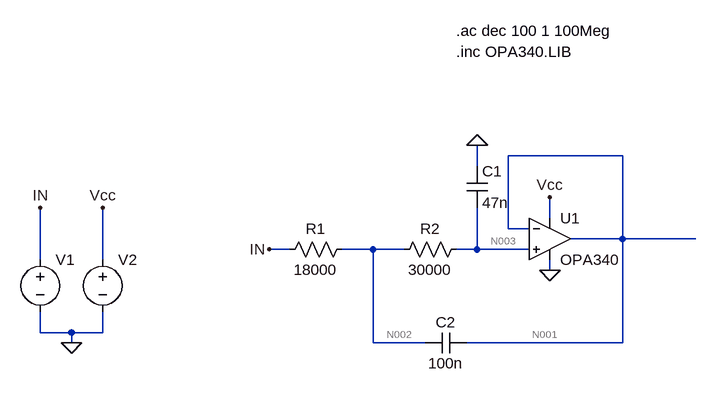
[diagram p0: schematic Sallen-Key-Filter.asc]
Sallen-Key-Filter.asc, the LTspice schematic file:
Version 4
SHEET 1 880 680
WIRE 448 112 272 112
WIRE 224 128 224 96
WIRE 336 208 336 176
WIRE 272 224 272 112
WIRE 304 224 272 224
WIRE 448 240 448 112
WIRE 448 240 368 240
WIRE 560 240 448 240
WIRE -64 256 -96 256
WIRE 64 256 16 256
WIRE 112 256 64 256
WIRE 224 256 224 192
WIRE 224 256 192 256
WIRE 304 256 224 256
WIRE -448 272 -448 192
WIRE -352 272 -352 192
WIRE 336 288 336 272
WIRE -448 384 -448 352
WIRE -400 384 -448 384
WIRE -352 384 -352 352
WIRE -352 384 -400 384
WIRE -400 400 -400 384
WIRE 64 400 64 256
WIRE 144 400 64 400
WIRE 448 400 448 240
WIRE 448 400 208 400
FLAG 224 96 0
FLAG 336 288 0
FLAG 336 176 Vcc
FLAG -96 256 IN
FLAG -400 400 0
FLAG -448 192 IN
FLAG -352 192 Vcc
SYMBOL res 32 240 R90
WINDOW 0 0 56 VBottom 2
WINDOW 3 32 56 VTop 2
SYMATTR InstName R1
SYMATTR Value 18000
SYMBOL res 208 240 R90
WINDOW 0 0 56 VBottom 2
WINDOW 3 32 56 VTop 2
SYMATTR InstName R2
SYMATTR Value 30000
SYMBOL cap 208 128 R0
SYMATTR InstName C1
SYMATTR Value 47n
SYMBOL cap 208 384 R90
WINDOW 0 0 32 VBottom 2
WINDOW 3 32 32 VTop 2
SYMATTR InstName C2
SYMATTR Value 100n
SYMBOL Opamps\\opamp2 336 176 R0
SYMATTR InstName U1
SYMATTR Value OPA340
SYMATTR SpiceModel OPA340
SYMBOL voltage -448 256 R0
WINDOW 39 0 0 Left 2
SYMATTR InstName V1
SYMATTR Value ""
SYMATTR Value2 AC 1
SYMBOL voltage -352 256 R0
WINDOW 3 24 96 Invisible 2
WINDOW 123 0 0 Left 2
WINDOW 39 0 0 Left 2
SYMATTR Value 5
SYMATTR InstName V2
TEXT 192 -48 Left 2 !.inc OPA340.LIB
TEXT 192 -80 Left 2 !.ac dec 100 1 100Meg

The netlist it stands for:
* Sallen-Key-Filter.asc
R1 N002 IN 18000
R2 N003 N002 30000
C1 0 N003 47n
C2 N001 N002 100n
XU1 N003 N001 Vcc 0 N001 OPA340 OPA340  ; pins In+ In- V+ V- OUT
V1 IN 0 AC 1
V2 Vcc 0 5
.inc OPA340.LIB
.ac dec 100 1 100Meg
.backanno
.end

* Results of the author's LTspice run, read from the files saved beside the schematic
* Operating Point, zero values left out:
*   V(n002) = 86.58 nV
*   V(n003) = 230.9 nV
*   V(n001) = 2.365 µV
*   V(vcc) = 5 V
*   I(R2) = 4.81 pA
*   I(R1) = 4.81 pA
*   I(V2) = -685.3 µA
*   I(V1) = 4.81 pA
*   Ix(u1:+) = -4.81 pA
*   Ix(u1:-) = -4.81 pA
*   Ix(u1:V+) = 685.3 µA
*   Ix(u1:V-) = -685.3 µA
*   Ix(u1:OUT) = 4.81 pA
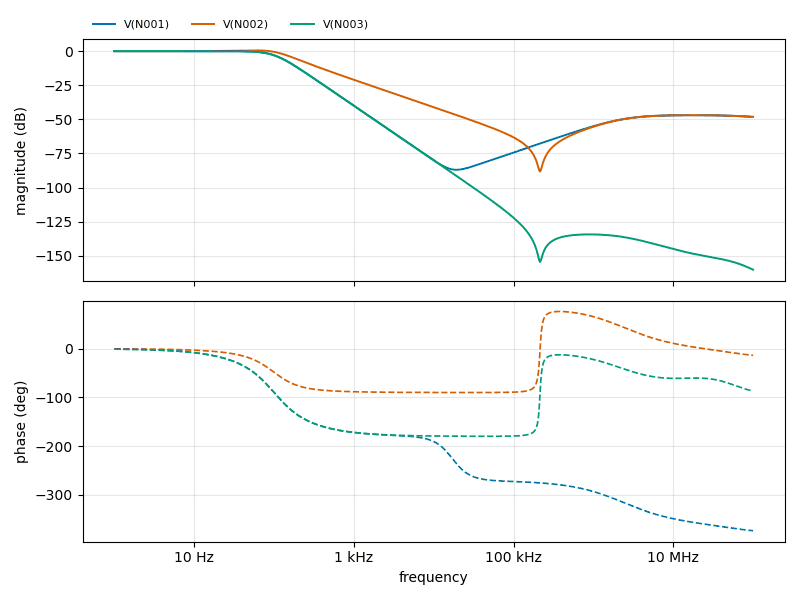
[diagram p1: AC Analysis of Sallen-Key-Filter.asc, plotted from the saved traces]
* AC Analysis, 1 run:
*   V(N001): -0.00 dB at 1 Hz, -48.18 dB at 100 MHz, peak -0.00 dB at 1 Hz, 3 dB below the peak at 99.75 Hz
*   V(N002): 0.00 dB at 1 Hz, -48.18 dB at 100 MHz, peak 0.54 dB at 58.88 Hz, 3 dB below the peak at 134.1 Hz
*   V(N003): -0.00 dB at 1 Hz, -160.19 dB at 100 MHz, peak -0.00 dB at 1 Hz, 3 dB below the peak at 99.75 Hz